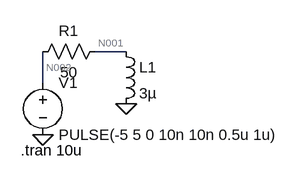
[diagram p0: schematic Draft2.asc]
Draft2.asc, the LTspice schematic file:
Version 4
SHEET 1 880 680
WIRE 192 80 144 80
WIRE 64 128 64 80
FLAG 64 208 0
FLAG 192 160 0
SYMBOL voltage 64 112 R0
WINDOW 123 0 0 Left 0
WINDOW 39 0 0 Left 0
SYMATTR InstName V1
SYMATTR Value PULSE(-5 5 0 10n 10n 0.5u 1u)
SYMBOL res 160 64 R90
WINDOW 0 0 56 VBottom 2
WINDOW 3 32 56 VTop 2
SYMATTR InstName R1
SYMATTR Value 50
SYMBOL ind 176 64 R0
SYMATTR InstName L1
SYMATTR Value 3µ
TEXT 30 232 Left 2 !.tran 10u

The netlist it stands for:
* Draft2.asc
V1 N002 0 PULSE(-5 5 0 10n 10n 0.5u 1u)
R1 N001 N002 50
L1 N001 0 3µ
.tran 10u
.backanno
.end

* Results of the author's LTspice run, read from the files saved beside the schematic
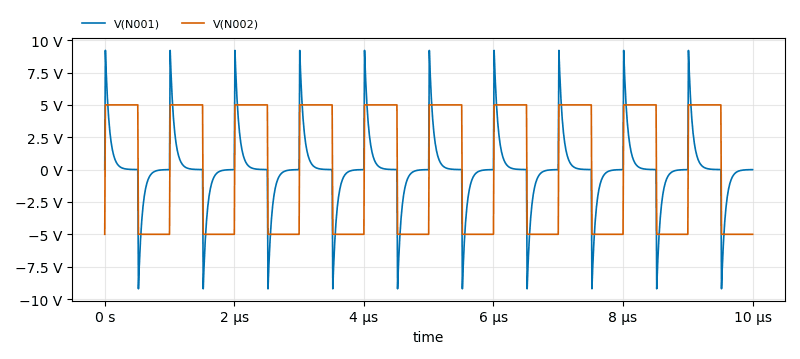
[diagram p1: Transient Analysis of Draft2.asc, plotted from the saved traces]
* Transient Analysis, 1 run:
*   V(N001): min -9.211 V, max 9.213 V, average 38.82 µV, rms 2.402 V, last -3.136 mV
*   V(N002): min -5 V, max 5 V, average 100 mV, rms 4.97 V, last -5 V